# EAGLE design Sensor-distance (EAGLE 6.5.0)
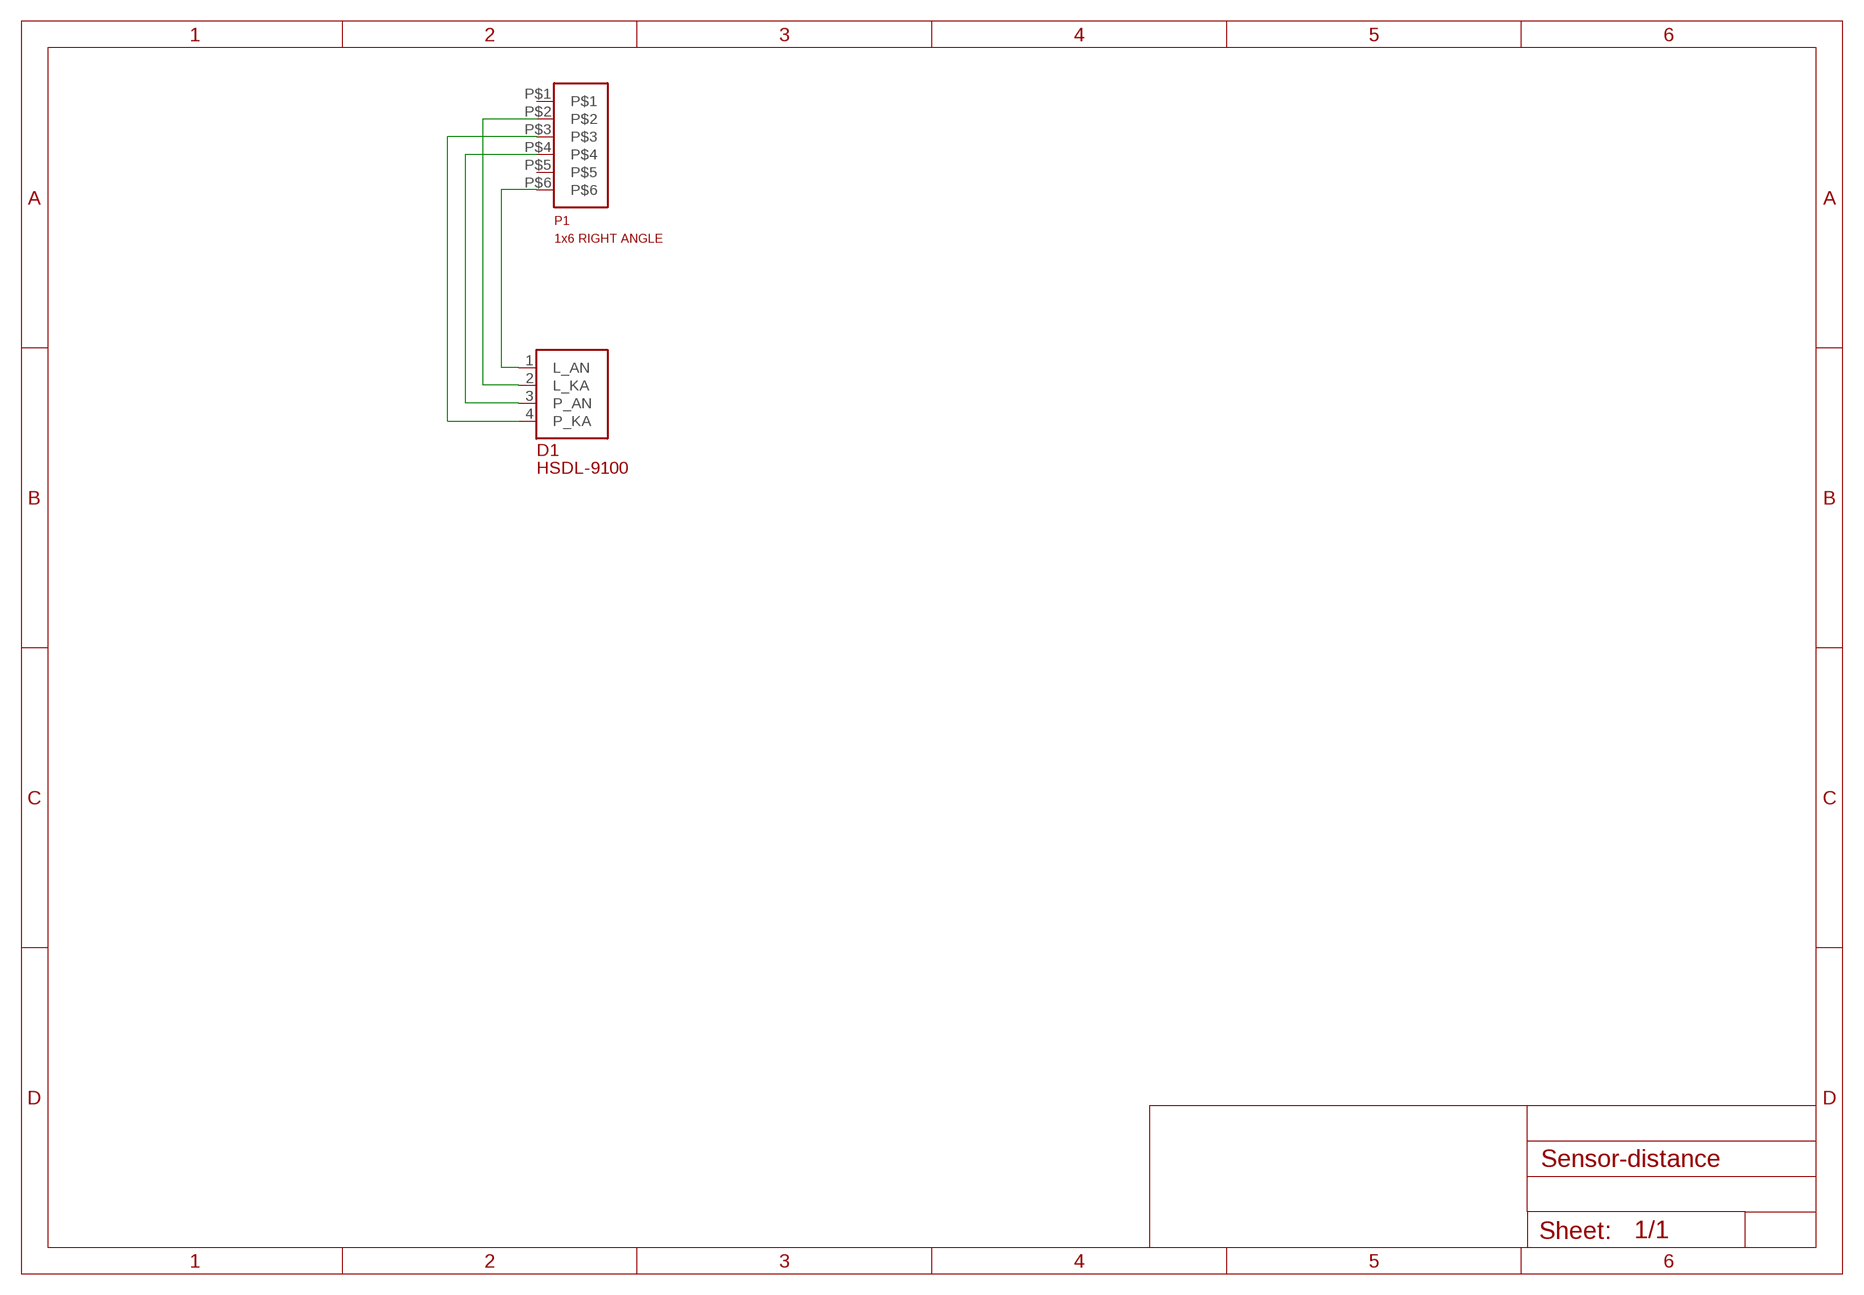
[diagram p0: schematic, sheet 1]

## Parts
D1  HSDL-9100  [HSDL-9100]
P1  1X6_RIGHT_ANGLE  [1X6_RIGHT_ANGLE]

## Nets
N$1: D1.1(L_AN) P1.P$6
N$2: D1.2(L_KA) P1.P$2
N$3: D1.3(P_AN) P1.P$4
N$4: D1.4(P_KA) P1.P$3
Unconnected: P1.P$1 P1.P$5

## Library data of the parts
D1 = sduino:HSDL-9100; MF: AVAGO TECHNOLOGIES; MPN: HSDL-9100-021; OC_FARNELL: 9613846
P1 = sduino:1X6_RIGHT_ANGLE; MF: GLOBAL CONNECTOR TECHNOLOGY; MPN: BG301-06-A-0540-L-B; OC_FARNELL: 2084270

## Board
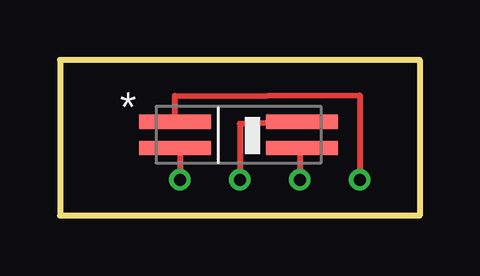
[diagram p1: board, top side]
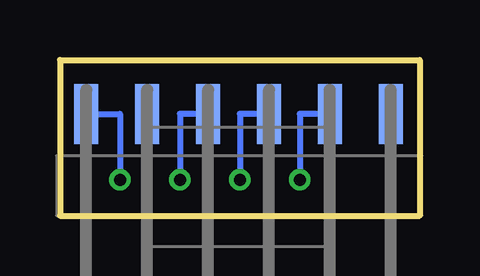
[diagram p2: board, bottom side, seen from below]

Size 15 x 6.5 mm. Coordinates in mm from the lower left corner, seen from the top.
Outline: 15,6.5 15,0 0,0 0,6.5 15,6.5
Copper layers (1*16): Top 0.035mm / dielectric 1.5mm / Bottom 0.035mm
Design rules "default *": minimum track width 10mil, minimum drill 24mil, track to track 8mil, track to pad 8mil, pad to pad 8mil, via to via 8mil, smd to smd 8mil, copper to edge 40mil, drill to drill 8mil, minimum pad ring 10mil, minimum via ring 8mil, stop-mask expansion 4mil, vias tented up to drill 50mil, thermal gap 10mil

### Footprints (pad centres in the part's own frame; a part is rotated, then mirrored left to right if it is on the bottom)
HSDL-9100 = smd 3 x 0.6: 1 0.8,1.725; 2 0.8,0.625; 3 6.1,0.625; 4 6.1,1.725
1X6_RIGHT_ANGLE = smd 1 x 2.5: P$1 0.5,1.25; P$2 3.04,1.25; P$3 5.58,1.25; P$4 8.12,1.25; P$5 10.66,1.25; P$6 13.2,1.25

### Placement (x,y rotation side)
D1  4,2.2 0 top
P1  0.7,5.5 180 bottom

### Tracks (layer width: path | path; a pad name or v marks a point on that pad's centre or on a via)
N$1  (via drill 0.5)
  Top 0.254: D1.1 4.8,5 12.5,5.03 v12.5,1.5
  Bottom 0.254: v12.5,1.5 12.5,4.25 P1.P$6
N$2  (via drill 0.5)
  Top 0.254: D1.2 5,2.73 v5,1.5
  Bottom 0.254: P1.P$2 5,4.25 v5,1.5
N$3  (via drill 0.5)
  Top 0.254: D1.3 10,2.73 v10,1.5
  Bottom 0.254: P1.P$4 10,4.25 v10,1.5
N$4  (via drill 0.5)
  Top 0.254: D1.4 7.5,3.83 v7.5,1.5
  Bottom 0.254: P1.P$3 7.5,4.25 v7.5,1.5